# EAGLE design M312B (EAGLE 6.6.0)
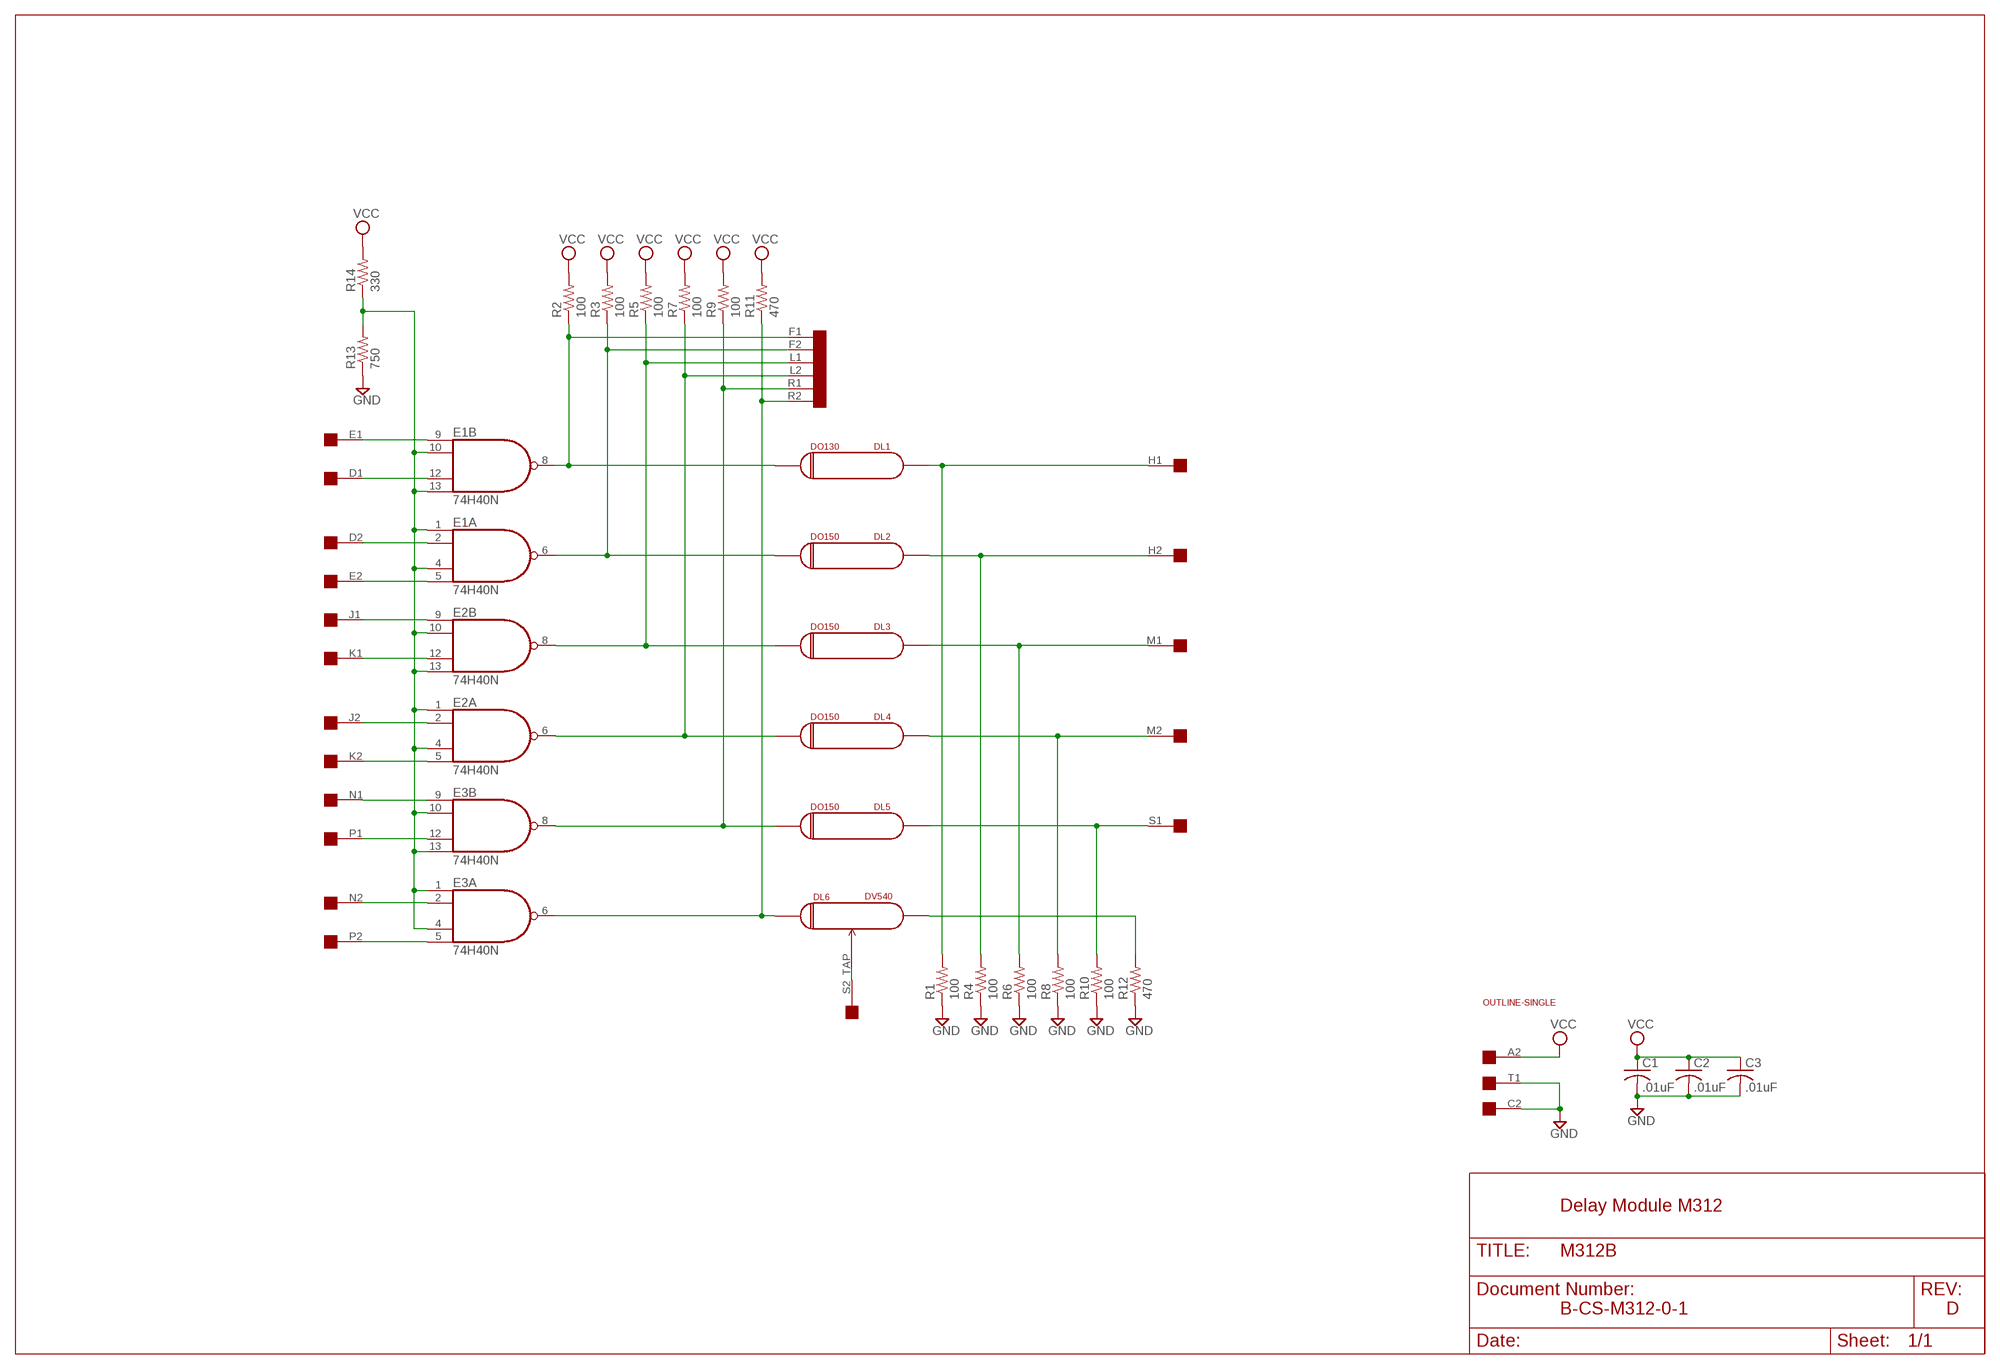
[diagram p0: schematic, sheet 1]

## Parts
C1  .01uF  C-US050-025X075  [C050-025X075]
C2  .01uF  C-US050-025X075  [C050-025X075]
C3  .01uF  C-US050-025X075  [C050-025X075]
DL1  DO130  RC-L-22  [RCL-L-XX-22]
DL2  DO150  RC-L-22  [RCL-L-XX-22]
DL3  DO150  RC-L-22  [RCL-L-XX-22]
DL4  DO150  RC-L-22  [RCL-L-XX-22]
DL5  DO150  RC-L-22  [RCL-L-XX-22]
DL6  DV540  [DV540]
E1  74H40N  74S20N  [DIL14]
E2  74H40N  74S20N  [DIL14]
E3  74H40N  74S20N  [DIL14]
R1  100  R-US_0207/10  [0207/10]
R2  100  R-US_0207/10  [0207/10]
R3  100  R-US_0207/10  [0207/10]
R4  100  R-US_0207/10  [0207/10]
R5  100  R-US_0207/10  [0207/10]
R6  100  R-US_0207/10  [0207/10]
R7  100  R-US_0207/10  [0207/10]
R8  100  R-US_0207/10  [0207/10]
R9  100  R-US_0207/10  [0207/10]
R10  100  R-US_0207/10  [0207/10]
R11  470  R-US_0207/10  [0207/10]
R12  470  R-US_0207/10  [0207/10]
R13  750  R-US_0207/10  [0207/10]
R14  330  R-US_0207/10  [0207/10]
U$1  OUTLINE-SINGLE  [SINGLE]
U$4  SINGLE  [EDGE-CON2]

## Nets
GND [power]: C1.2 C2.2 C3.2 R1.1 R4.1 R6.1 R8.1 R10.1 R12.1 R13.1 U$4.C2 U$4.T1
N$1: E1.1(A:I0) E1.4(A:I2) E1.10(B:I1) E1.13(B:I3) E2.1(A:I0) E2.4(A:I2) E2.10(B:I1) E2.13(B:I3) E3.1(A:I0) E3.4(A:I2) E3.10(B:I1) E3.13(B:I3) R13.2 R14.1
N$2: DL6.IN E3.6(A:O) R11.1 U$4.R2
N$3: DL5.IN R10.2 U$4.S1
N$4: DL1.IN R1.2 U$4.H1
N$5: DL4.IN R8.2 U$4.M2
N$6: DL3.IN R6.2 U$4.M1
N$7: DL2.IN R4.2 U$4.H2
N$8: DL1.OUT E1.8(B:O) R2.1 U$4.F1
N$9: DL2.OUT E1.6(A:O) R3.1 U$4.F2
N$10: DL3.OUT E2.8(B:O) R5.1 U$4.L1
N$11: DL4.OUT E2.6(A:O) R7.1 U$4.L2
N$12: DL5.OUT E3.8(B:O) R9.1 U$4.R1
N$13: DL6.OUT R12.2
N$14: E3.2(A:I1) U$4.N2
N$15: E1.5(A:I3) U$4.E2
N$16: E3.5(A:I3) U$4.P2
N$17: E3.12(B:I2) U$4.P1
N$18: E3.9(B:I0) U$4.N1
N$19: E2.5(A:I3) U$4.K2
N$20: E2.12(B:I2) U$4.K1
N$21: E2.2(A:I1) U$4.J2
N$22: E1.9(B:I0) U$4.E1
N$23: E1.12(B:I2) U$4.D1
N$24: E1.2(A:I1) U$4.D2
N$25: E2.9(B:I0) U$4.J1
N$26: DL6.TAP U$4.S2
VCC [power]: C1.1 C2.1 C3.1 R2.2 R3.2 R5.2 R7.2 R9.2 R11.2 R14.2 U$4.A2
Unconnected: U$4.A1 U$4.B1 U$4.B2 U$4.C1 U$4.T2 U$4.U1 U$4.U2 U$4.V1 U$4.V2

## Notes on the sheet
- Delay Module M312
- B-CS-M312-0-1 | D

## Power pins joined to a net without a drawn wire
GND: DL1.GND@1(GND) DL1.GND@2(GND) DL2.GND@1(GND) DL2.GND@2(GND) DL3.GND@1(GND) DL3.GND@2(GND) DL4.GND@1(GND) DL4.GND@2(GND) DL5.GND@1(GND) DL5.GND@2(GND) DL6.GND@1(GND) DL6.GND@2(GND) E1.7(P:GND) E2.7(P:GND) E3.7(P:GND)
VCC: E1.14(P:VCC) E2.14(P:VCC) E3.14(P:VCC)

## Library data of the parts
C1-C3 = rcl:C-US: CAPACITOR, American symbol
DL1-DL5 = dec-con:RC-L-22: Delay Line
DL6 = dec-con:DV540: Delay Line with Variable Tap
E1-E3 = 74xx-us:74*20: Dual 4-input NAND gate
R1-R14 = rcl:R-US_: RESISTOR, American symbol
U$1 = dec-con:OUTLINE-*: Board outlines for DEC boards.
U$4 = dec-con:SINGLE: Single-Height DEC board

## Net classes
1 power: width 0.813 mm

## Board
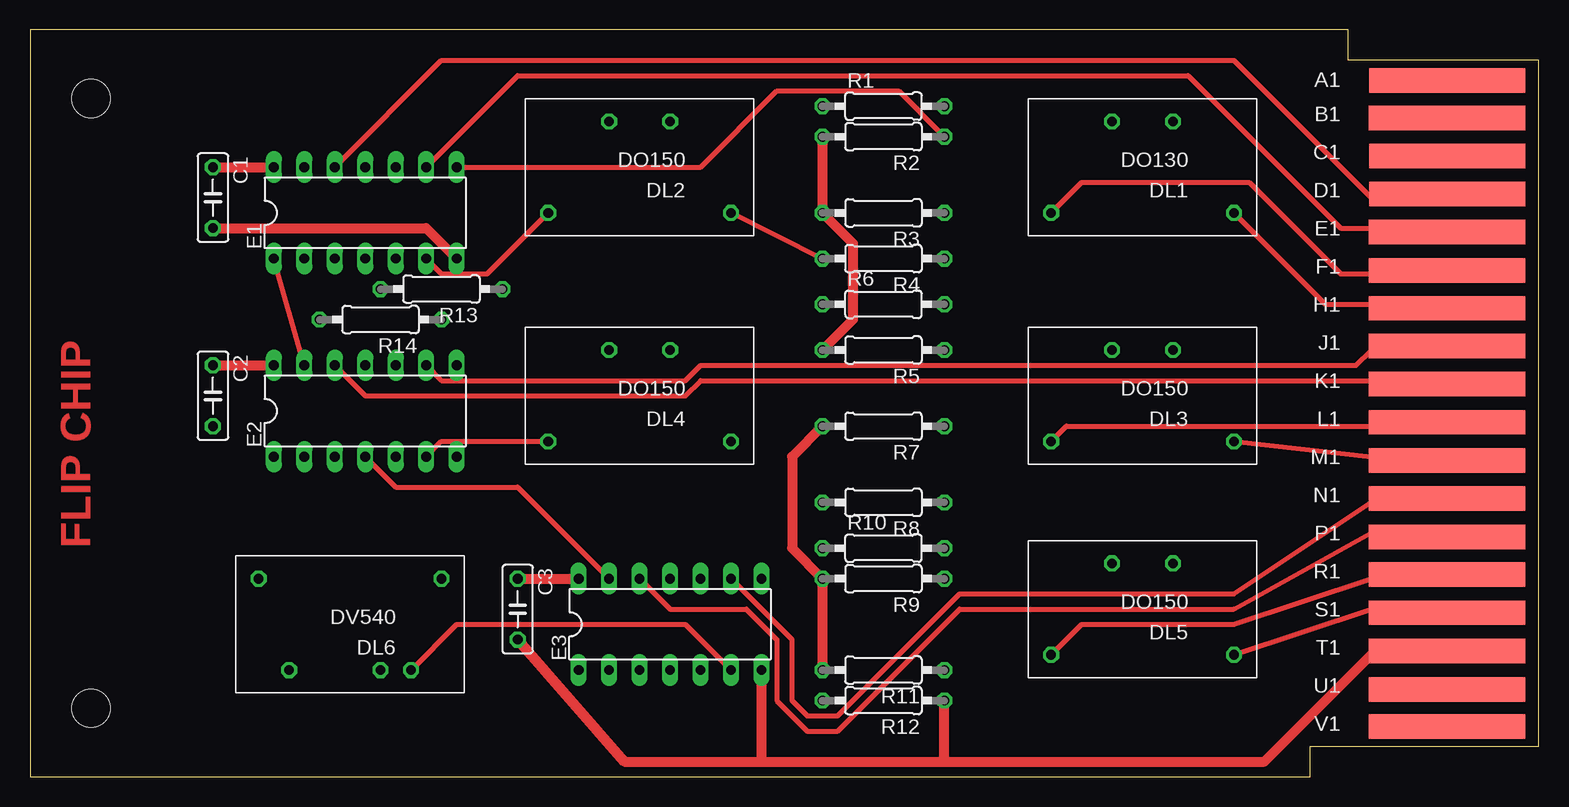
[diagram p1: board, top side]
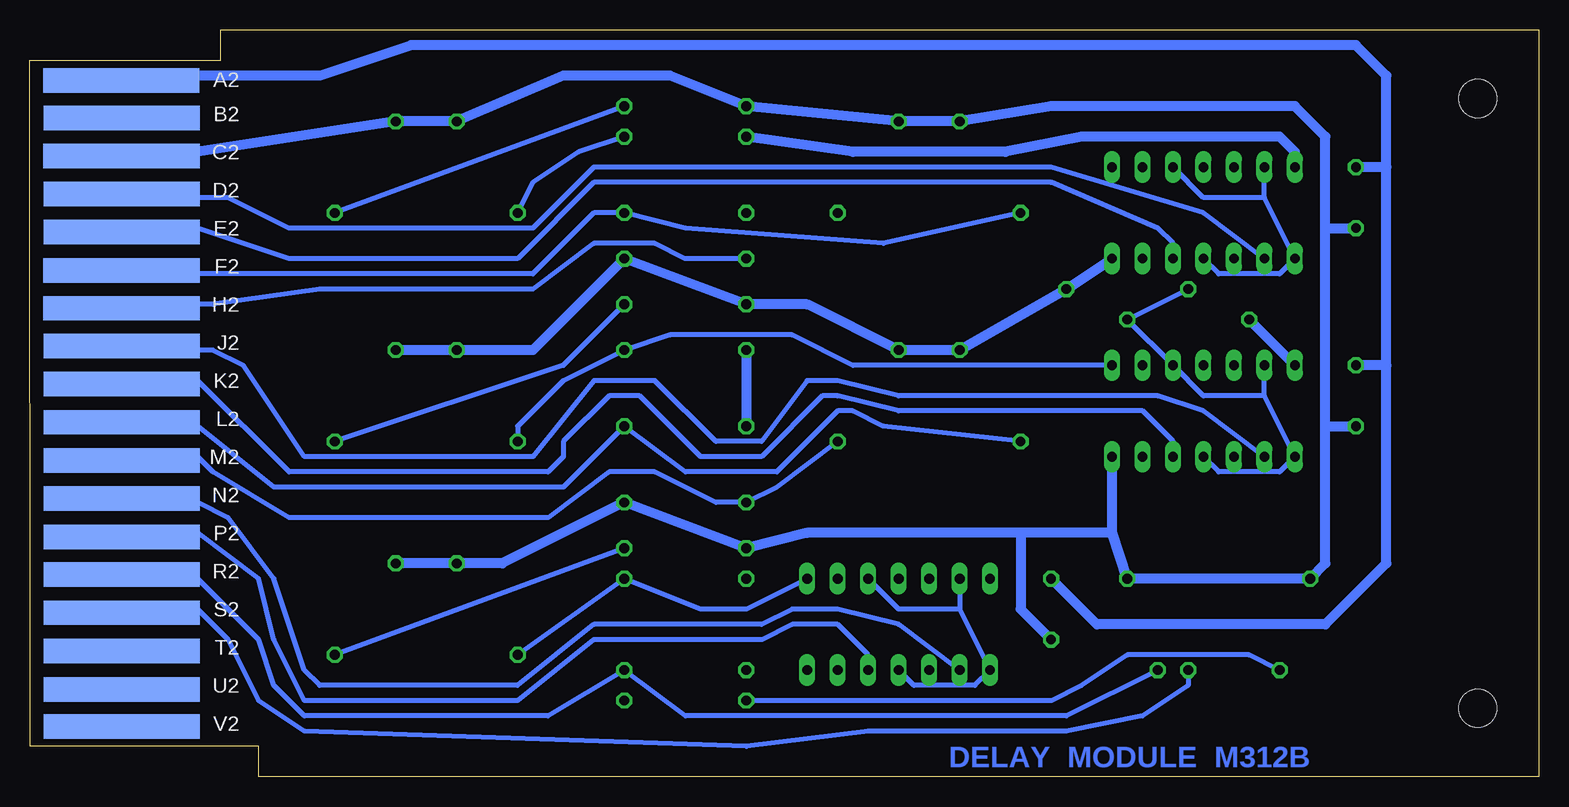
[diagram p2: board, bottom side, seen from below]

Size 125.73 x 62.23 mm. Coordinates in mm from the lower left corner, seen from the top.
Copper layers (1+16): Top 0.035mm / dielectric 1.5mm / Bottom 0.035mm
Design rules "16mils": minimum track width 16mil, minimum drill 22mil, track to track 15mil, track to pad 10mil, pad to pad 10mil, via to via 10mil, smd to smd 10mil, copper to edge 25mil, drill to drill 10mil, minimum pad ring 10mil, minimum via ring 8mil, stop-mask expansion 0mil, vias tented up to drill 0mil, thermal gap 10mil

### Footprints (pad centres in the part's own frame; a part is rotated, then mirrored left to right if it is on the bottom)
C050-025X075 = drill 0.813 octagon: 1 -2.54,0; 2 2.54,0
RCL-L-XX-22 = drill 0.813 octagon: GND@1 6.35,1.27; GND@2 11.43,1.27; IN 1.27,8.89; OUT 16.51,8.89
DV540 = drill 0.813 octagon: GND@1 -7.62,-3.81; GND@2 7.62,-3.81; IN -5.08,3.81; OUT 5.08,3.81; TAP -2.54,3.81
DIL14 = drill 0.813 long: 1 -7.62,-3.81; 2 -5.08,-3.81; 3 -2.54,-3.81; 4 0,-3.81; 5 2.54,-3.81; 6 5.08,-3.81; 7 7.62,-3.81; 8 7.62,3.81; 9 5.08,3.81; 10 2.54,3.81; 11 0,3.81; 12 -2.54,3.81; 13 -5.08,3.81; 14 -7.62,3.81
0207/10 = drill 0.813 octagon: 1 -5.08,0; 2 5.08,0
SINGLE = hole 3.175: 120.65,56.515; 120.65,5.715
EDGE-CON2 = smd 13.017 x 2.032: A1 7.633,4.207; B1 7.639,7.327; C1 7.636,10.489; D1 7.633,13.665; E1 7.642,16.84; F1 7.642,20.041; H1 7.642,23.19; J1 7.642,26.34; K1 7.642,29.515; L1 7.642,32.69; M1 7.642,35.89; N1 7.642,39.04; P1 7.642,42.24; R1 7.642,45.39; S1 7.642,48.565; T1 7.642,51.74; U1 7.642,54.966; V1 7.642,58.026 | smd 13.017 x 2.032 bottom: A2 7.614,4.207; B2 7.642,7.328; C2 7.617,10.49; D2 7.642,13.665; E2 7.642,16.84; F2 7.617,20.041; H2 7.617,23.19; J2 7.642,26.34; K2 7.642,29.515; L2 7.642,32.69; M2 7.642,35.89; N2 7.642,39.04; P2 7.642,42.24; R2 7.642,45.39; S2 7.642,48.565; T2 7.642,51.74; U2 7.642,54.966; V2 7.642,58.026

### Placement (x,y rotation side)
C1  15.24,48.26 270 top
C2  15.24,31.75 270 top
C3  40.64,13.97 270 top
DL1  101.6,55.88 180 top
DL2  59.69,55.88 180 top
DL3  101.6,36.83 180 top
DL4  59.69,36.83 180 top
DL5  101.6,19.05 180 top
DL6  26.67,12.7 180 top
E1  27.94,46.99 0 top
E2  27.94,30.48 0 top
E3  53.34,12.7 0 top
R1  71.12,55.88 0 top
R2  71.12,53.34 180 top
R3  71.12,46.99 180 top
R4  71.12,43.18 180 top
R5  71.12,35.56 180 top
R6  71.12,39.37 0 top
R7  71.12,29.21 180 top
R8  71.12,22.86 180 top
R9  71.12,16.51 180 top
R10  71.12,19.05 0 top
R11  71.12,8.89 180 top
R12  71.12,6.35 180 top
R13  34.29,40.64 180 top
R14  29.21,38.1 180 top
U$1  125.73,62.23 180 top
U$3  [FLIPCHIP]  0,0 0 top
U$4  125.73,62.23 180 top

### Tracks (layer width: path | path; a pad name or v marks a point on that pad's centre or on a via)
GND
  Top 0.813: C3.2 49.53,1.27 60.96,1.27 | 60.96,1.27 E3.7 | 60.96,1.27 76.2,1.27 | 76.2,1.27 R12.1 | U$4.T1 116.84,10.16 111.76,10.16 102.87,1.27 76.2,1.27 | C1.2 33.02,45.72 E1.7
  Bottom 0.813: U$4.C2 116.84,52.07 111.76,52.07 DL1.GND@1 DL1.GND@2 81.28,58.42 72.39,58.42 R1.1 DL2.GND@1 DL2.GND@2 40.64,55.88 20.32,55.88 17.78,53.34 17.78,45.72 | 17.78,29.21 17.78,17.78 DL6.GND@2 DL6.GND@1 35.56,20.32 | 17.78,29.21 17.78,45.72 | 35.56,20.32 E2.7 | C3.2 43.18,13.97 43.18,20.32 | 35.56,20.32 43.18,20.32 | E1.7 R13.1 DL4.GND@2 DL4.GND@1 60.96,39.37 R6.1 R4.1 83.82,35.56 DL3.GND@2 DL3.GND@1 | 43.18,20.32 60.96,20.32 R10.1 R8.1 86.36,17.78 DL5.GND@2 DL5.GND@1 | 17.78,45.72 C1.2 | 17.78,29.21 C2.2
N$1
  Top 0.406: E2.4 30.48,24.13 40.64,24.13 E3.13 | E2.13 E1.1
  Bottom 0.406: E3.4 52.07,7.62 46.99,7.62 E3.1 48.26,13.97 | 22.86,48.26 E1.1 21.59,41.91 26.67,41.91 E1.4 | 22.86,48.26 E1.13 | E1.10 27.94,48.26 22.86,48.26 | R13.2 R14.1 E2.10 27.94,31.75 22.86,31.75 | 22.86,31.75 E2.13 | 22.86,31.75 E2.1 21.59,25.4 26.67,25.4 E2.4 | E3.13 48.26,13.97 | E3.10 53.34,13.97 48.26,13.97
N$2
  Top 0.406: E3.6 54.61,12.7 35.56,12.7 DL6.IN
  Bottom 0.406: DL6.IN 39.37,5.08 71.12,5.08 R11.1 82.55,5.08 102.87,5.08 105.41,7.62 106.68,11.43 111.76,16.51 116.84,16.51 U$4.R2
N$3
  Top 0.406: U$4.S1 116.84,13.97 111.76,13.97 DL5.IN
  Bottom 0.406: R10.2 DL5.IN
N$4
  Top 0.406: U$4.H1 116.84,39.37 107.95,39.37 DL1.IN
  Bottom 0.406: R1.2 DL1.IN
N$5
  Bottom 0.406: DL4.IN 63.5,24.13 R8.2 68.58,22.86 73.66,25.4 77.47,25.4 82.55,21.59 104.14,21.59 110.49,25.4 111.76,26.67 116.84,26.67 U$4.M2
N$6
  Top 0.406: U$4.M1 116.84,26.67 111.76,26.67 DL3.IN
  Bottom 0.406: R6.2 81.28,34.29 DL3.IN
N$7
  Top 0.406: DL2.IN R4.2
  Bottom 0.406: R4.2 71.12,43.18 73.66,44.45 78.74,44.45 83.82,40.64 101.6,40.64 110.49,39.37 116.84,39.37 U$4.H2
N$8
  Top 0.406: U$4.F1 116.84,41.91 109.22,41.91 101.6,49.53 87.63,49.53 DL1.OUT | E1.8 55.88,50.8 62.23,57.15 72.39,57.15 R2.1
  Bottom 0.406: R2.1 80.01,52.07 83.82,49.53 DL1.OUT
N$9
  Top 0.406: E1.6 34.29,41.91 38.1,41.91 DL2.OUT
  Bottom 0.406: DL2.OUT 54.61,44.45 71.12,45.72 R3.1 78.74,46.99 83.82,41.91 116.84,41.91 U$4.F2
N$10
  Top 0.406: U$4.L1 116.84,29.21 86.36,29.21 DL3.OUT
  Bottom 0.406: DL3.OUT 85.09,29.21 81.28,33.02 R5.1 72.39,36.83 62.23,36.83 57.15,34.29 E2.8
N$11
  Top 0.406: DL4.OUT 34.29,27.94 E2.6
  Bottom 0.406: DL4.OUT 54.61,29.21 57.15,30.48 58.42,30.48 63.5,25.4 71.12,25.4 R7.1 81.28,24.13 105.41,24.13 111.76,29.21 116.84,29.21 U$4.L2
N$12
  Top 0.406: U$4.R1 116.84,16.51 111.76,16.51 100.33,12.7 87.63,12.7 DL5.OUT
  Bottom 0.406: DL5.OUT R9.1 69.85,13.97 66.04,13.97 E3.8
N$13
  Bottom 0.406: DL6.OUT 24.13,10.16 34.29,10.16 38.1,7.62 40.64,6.35 R12.2
N$14
  Bottom 0.406: E3.2 53.34,12.7 58.42,13.97 62.23,13.97 64.77,12.7 78.74,12.7 85.09,7.62 101.6,7.62 102.87,8.89 105.41,16.51 109.22,21.59 111.76,22.86 116.84,22.86 U$4.N2
N$15
  Bottom 0.406: E1.5 30.48,44.45 31.75,45.72 40.64,49.53 78.74,49.53 85.09,43.18 104.14,43.18 111.76,45.72 115.57,45.72 U$4.E2
N$16
  Bottom 0.406: E3.5 55.88,10.16 58.42,12.7 62.23,12.7 64.77,11.43 78.74,11.43 85.09,6.35 102.87,6.35 105.41,11.43 106.68,16.51 111.76,20.32 116.84,20.32 U$4.P2
N$17
  Top 0.406: E3.12 53.34,13.97 59.69,13.97 62.23,11.43 62.23,6.35 64.77,3.81 67.31,3.81 77.47,13.97 100.33,13.97 111.76,20.32 116.84,20.32 U$4.P1
N$18
  Top 0.406: E3.9 63.5,11.43 63.5,6.35 64.77,5.08 67.31,5.08 77.47,15.24 100.33,15.24 111.76,22.86 116.84,22.86 U$4.N1
N$19
  Bottom 0.406: E2.5 30.48,27.94 33.02,30.48 53.34,30.48 58.42,31.75 59.69,31.75 64.77,26.67 69.85,26.67 74.93,31.75 77.47,31.75 81.28,27.94 81.28,26.67 82.55,25.4 104.14,25.4 111.76,33.02 115.57,33.02 U$4.K2
N$20
  Top 0.406: U$4.K1 116.84,33.02 55.88,33.02 54.61,31.75 27.94,31.75 E2.12
N$21
  Bottom 0.406: E2.2 27.94,30.48 31.75,31.75 53.34,31.75 58.42,33.02 60.96,33.02 64.77,27.94 68.58,27.94 73.66,33.02 78.74,33.02 83.82,26.67 102.87,26.67 107.95,34.29 110.49,35.56 116.84,35.56 U$4.J2
N$22
  Top 0.406: E1.9 40.64,58.42 96.52,58.42 109.22,45.72 116.84,45.72 U$4.E1
N$23
  Top 0.406: U$4.D1 116.84,48.26 111.76,48.26 100.33,59.69 34.29,59.69 E1.12
N$24
  Bottom 0.406: E1.2 27.94,46.99 40.64,50.8 78.74,50.8 83.82,45.72 104.14,45.72 109.22,48.26 116.84,48.26 U$4.D2
N$25
  Top 0.406: U$4.J1 116.84,35.56 111.76,35.56 110.49,34.29 55.88,34.29 54.61,33.02 34.29,33.02 E2.9
N$26
  Bottom 0.406: DL6.TAP 29.21,7.62 33.02,5.08 39.37,3.81 55.88,3.81 66.04,2.54 102.87,3.81 106.68,6.35 109.22,11.43 111.76,13.97 115.57,13.97 U$4.S2
VCC
  Top 0.813: C3.1 E3.14 | C2.1 E2.14 | C1.1 E1.14 | R11.2 R9.2 63.5,19.05 63.5,26.67 R7.2 | R5.2 68.58,38.1 68.58,44.45 R3.2 R2.2
  Bottom 0.813: U$4.A2 116.84,58.42 101.6,58.42 93.98,60.96 15.24,60.96 12.7,58.42 12.7,50.8 | 12.7,50.8 C1.1 | 12.7,34.29 C2.1 | 12.7,34.29 12.7,50.8 | C3.1 36.83,12.7 17.78,12.7 12.7,17.78 12.7,34.29 | E1.14 20.32,52.07 21.59,53.34 38.1,53.34 44.45,52.07 57.15,52.07 R2.2 | R5.2 R7.2 | E2.14 R14.2

### Text on the board
Bottom: DELAY MODULE M312B